# Altium schematic sheet Temperature.SchDoc
size A4; PageSetup: Record=PageOptions|CenterHorizontal=True|CenterVertical=True|PrintScale=1.00|XCorrection=1.00|YCorrection=1.00|PrintKind=1|BorderSize=5000000|LeftOffset=0|BottomOffset=0|Orientation=2|PaperLength=1000|PaperWidth=1000|Scale=100|PaperSource=7|PrintQuality=-4|MediaType=1|DitherType=10|PaperKind=A4 (210 x 297 mm)|PrintScaleMode=1
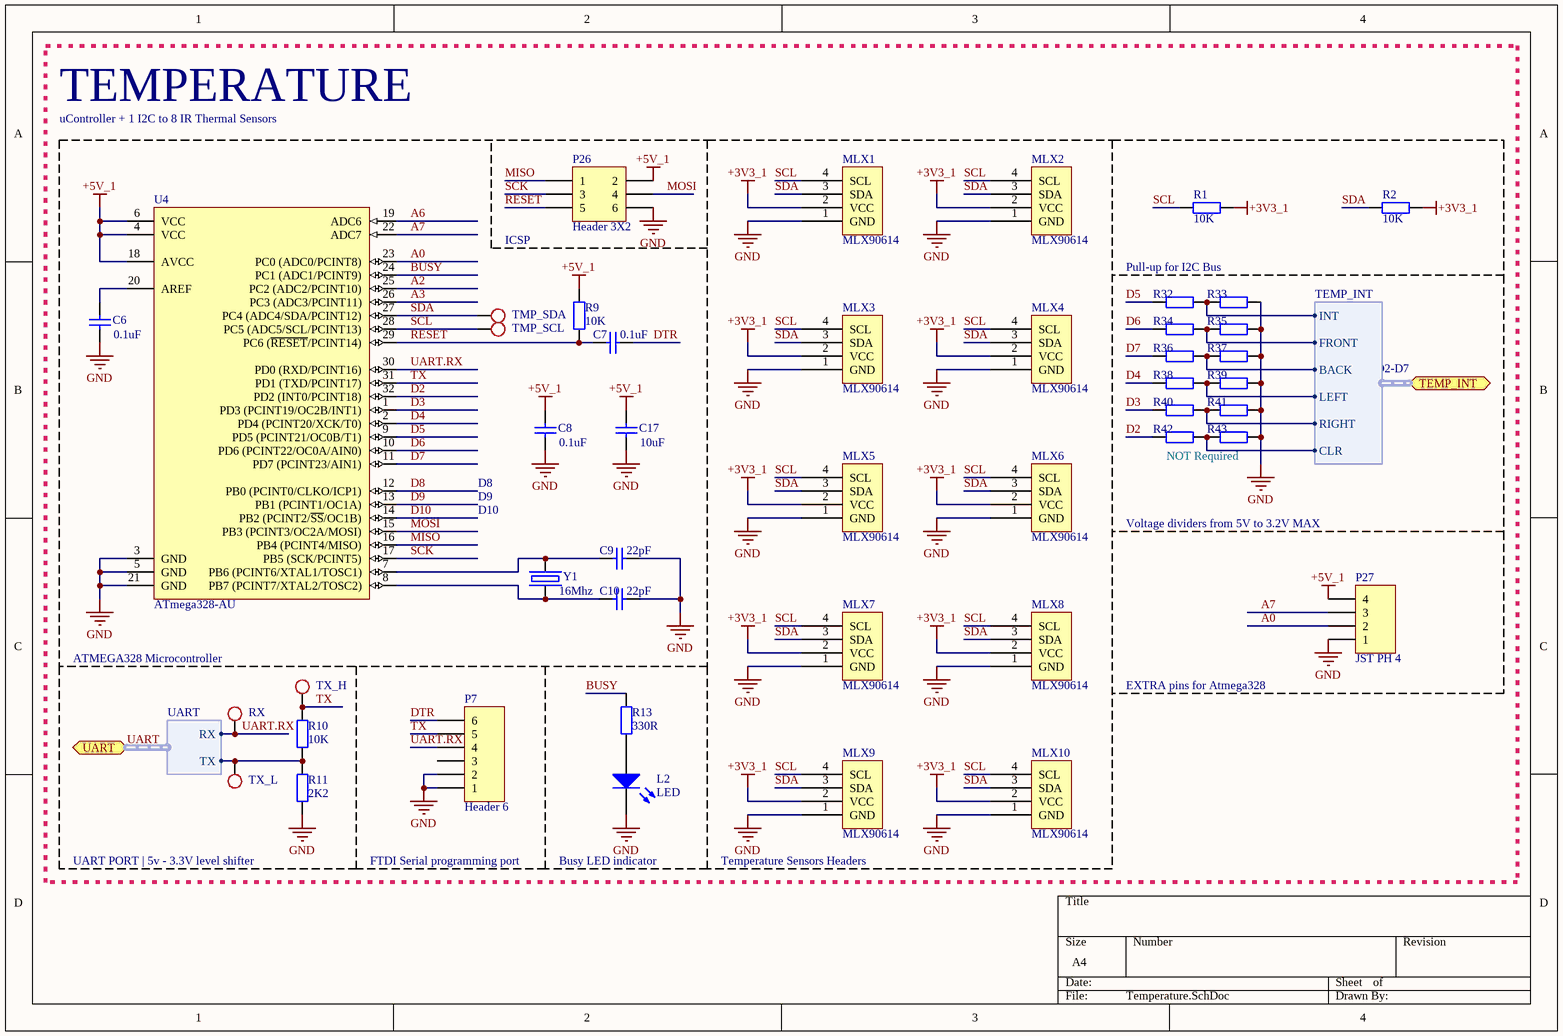
[diagram p0: Temperature.SchDoc]

## Parts
C6  0.1uF  [C0805]
C7  0.1uF  [C0805]
C8  0.1uF  [C0805]
C9  22pF  [C0805]
C10  22pF  [C0805]
C17  10uF  [C1206]
L2  LED  [LED0805]
MLX1  MLX90614  [MLX-BREAKOUT]
MLX2  MLX90614  [MLX-BREAKOUT]
MLX3  MLX90614  [MLX-BREAKOUT]
MLX4  MLX90614  [MLX-BREAKOUT]
MLX5  MLX90614  [MLX-BREAKOUT]
MLX6  MLX90614  [MLX-BREAKOUT]
MLX7  MLX90614  [MLX-BREAKOUT]
MLX8  MLX90614  [MLX-BREAKOUT]
MLX9  MLX90614  [MLX-BREAKOUT]
MLX10  MLX90614  [MLX-BREAKOUT]
P7  Header 6  [HDR1X6]
P26  Header 3X2  [HDR2X3]
P27  JST PH 4  [B4B-PH-K]
R1  10K  [RES1206]
R2  10K  [RES1206]
R9  10K  [RES1206]
R10  10K  [RES1206]
R11  2K2  [RES1206]
R13  330R  [RES1206]
R32  10K  [RES1206]  (value not drawn)
R33  2K2  [RES1206]  (value not drawn)
R34  10K  [RES1206]  (value not drawn)
R35  2K2  [RES1206]  (value not drawn)
R36  10K  [RES1206]  (value not drawn)
R37  2K2  [RES1206]  (value not drawn)
R38  10K  [RES1206]  (value not drawn)
R39  2K2  [RES1206]  (value not drawn)
R40  10K  [RES1206]  (value not drawn)
R41  2K2  [RES1206]  (value not drawn)
R42  10K  [RES1206]  (value not drawn)
R43  2K2  [RES1206]  (value not drawn)
RX  Test Point  [TP1]  (value not drawn)  (no BOM)
TMP_SCL  Test Point  [TP1]  (value not drawn)  (no BOM)
TMP_SDA  Test Point  [TP1]  (value not drawn)  (no BOM)
TX_H  Test Point  [TP1]  (value not drawn)  (no BOM)
TX_L  Test Point  [TP1]  (value not drawn)  (no BOM)
U4  ATmega328-AU  [32A_N]
Y1  16Mhz  [OSC-2-PIN-TH]

## Ports
TEMP_INT (harness TEMP_INT), UART (harness UART)

## Harnesses
UART: RX, TX
TEMP_INT: INT, FRONT, BACK, LEFT, RIGHT, CLR

## Nets
+3V3_1: MLX1.2(VCC) MLX2.2(VCC) MLX3.2(VCC) MLX4.2(VCC) MLX5.2(VCC) MLX6.2(VCC) MLX7.2(VCC) MLX8.2(VCC) MLX9.2(VCC) MLX10.2(VCC) R1.2 R2.2
+5V_1: C8.2 C17.2 P26.2 P27.4 R9.1 U4.4(VCC) U4.6(VCC) U4.18(AVCC)
GND: C6.1 C8.1 C9.2 C10.2 C17.1 L2.2(K) MLX1.1(GND) MLX2.1(GND) MLX3.1(GND) MLX4.1(GND) MLX5.1(GND) MLX6.1(GND) MLX7.1(GND) MLX8.1(GND) MLX9.1(GND) MLX10.1(GND) P7.1 P7.2 P26.6 P27.1 R11.1 R33.2 R35.2 R37.2 R39.2 R41.2 R43.2 U4.3(GND) U4.5(GND) U4.21(GND)
A0: P27.2 U4.23(PC0_(ADC0/PCINT8))
A2: U4.25(PC2_(ADC2/PCINT10))
A3: U4.26(PC3_(ADC3/PCINT11))
A6: U4.19(ADC6)
A7: P27.3 U4.22(ADC7)
BUSY: R13.2 U4.24(PC1_(ADC1/PCINT9))
D2: R42.1 U4.32(PD2_(INT0/PCINT18))
D3: R40.1 U4.1(PD3_(PCINT19/OC2B/INT1))
D4: R38.1 U4.2(PD4_(PCINT20/XCK/T0))
D5: R32.1 U4.9(PD5_(PCINT21/OC0B/T1))
D6: R34.1 U4.10(PD6_(PCINT22/OC0A/AIN0))
D7: R36.1 U4.11(PD7_(PCINT23/AIN1))
D8: U4.12(PB0_(PCINT0/CLKO/ICP1))
D9: U4.13(PB1_(PCINT1/OC1A))
D10: U4.14(PB2_(PCINT2/~{SS}/OC1B))
DTR: C7.2 P7.6
MISO: P26.1 U4.16(PB4_(PCINT4/MISO))
MOSI: P26.4 U4.15(PB3_(PCINT3/OC2A/MOSI))
RESET: C7.1 P26.5 R9.2 U4.29(PC6_(~{RESET}/PCINT14))
SCK: P26.3 U4.17(PB5_(SCK/PCINT5))
SCL: MLX1.4(SCL) MLX2.4(SCL) MLX3.4(SCL) MLX4.4(SCL) MLX5.4(SCL) MLX6.4(SCL) MLX7.4(SCL) MLX8.4(SCL) MLX9.4(SCL) MLX10.4(SCL) R1.1 TMP_SCL.1 U4.28(PC5_(ADC5/SCL/PCINT13))
SDA: MLX1.3(SDA) MLX2.3(SDA) MLX3.3(SDA) MLX4.3(SDA) MLX5.3(SDA) MLX6.3(SDA) MLX7.3(SDA) MLX8.3(SDA) MLX9.3(SDA) MLX10.3(SDA) R2.1 TMP_SDA.1 U4.27(PC4_(ADC4/SDA/PCINT12))
TX: P7.5 R10.2 TX_H.1 U4.31(PD1_(TXD/PCINT17))
UART.RX: P7.4 RX.1 U4.30(PD0_(RXD/PCINT16)) ; port UART.RX
UART.TX: R10.1 R11.2 TX_L.1 ; port UART.TX
NetC6_2: C6.2 U4.20(AREF)
NetC9_1: C9.1 U4.7(PB6_(PCINT6/XTAL1/TOSC1)) Y1.1
NetC10_1: C10.1 U4.8(PB7_(PCINT7/XTAL2/TOSC2)) Y1.2
NetL2_1: L2.1(A) R13.1
NetR32_2: R32.2 R33.1 ; port TEMP_INT.INT
NetR34_2: R34.2 R35.1 ; port TEMP_INT.FRONT
NetR36_2: R36.2 R37.1 ; port TEMP_INT.BACK
NetR38_2: R38.2 R39.1 ; port TEMP_INT.LEFT
NetR40_2: R40.2 R41.1 ; port TEMP_INT.RIGHT
NetR42_2: R42.2 R43.1 ; port TEMP_INT.CLR

Not connected (* = marked no-connect by the designer): P7 3

## Buses and harness runs
harness UART = port UART

## Notes on the sheet
- TEMPERATURE
- uController + 1 I2C to 8 IR Thermal Sensors
- ICSP
- Pull-up for I2C Bus
- D2-D7
- D8
- D9
- D10
- NOT Required
- Voltage dividers from 5V to 3.2V MAX
- ATMEGA328 Microcontroller
- EXTRA pins for Atmega328
- UART PORT | 5v - 3.3V level shifter
- FTDI Serial programming port
- Busy LED indicator
- (near MLX9) Temperature Sensors Headers

## Library data of the parts
C6-C10 C17 = Cap Semi: Capacitor (Semiconductor SIM Model); Published: 8-Jun-2000; LatestRevisionDate: 29-May-2009; LatestRevisionNote: IPC-7351 Footprint Added.; PackageReference: C1206; Publisher: Altium Limited; PackageDescription: Chip Capacitor
MLX1-MLX10 = MLX-BREAKOUT
P7 = Header 6: Header, 6-Pin; LatestRevisionDate: 17-Jul-2002; LatestRevisionNote: Re-released for DXP Platform.; Publisher: Altium Limited
P26 = Header 3X2: Header, 3-Pin, Dual row; LatestRevisionDate: 17-Jul-2002; LatestRevisionNote: Re-released for DXP Platform.; Publisher: Altium Limited
R1 R2 R9-R11 R13 R32-R43 = RES
RX TMP_SCL TMP_SDA TX_H TX_L = Test Point: Test Point for Osciloscope measurements
U4 = ATmega328-AU: 8-bit AVR Microcontroller, 32KB Flash, 1KB EEPROM, 2KB SRAM, 32-pin TQFP, Industrial Grade (-40°C to 85°C); Published: 1-Apr-2010; DatasheetVersion: revA, Jan-2010; PackageVersion: revB, Oct-2001; PackageReference: 32A; Publisher: Altium Limited; PackageDescription: 32-Lead, 7x7x1.0 mm Body, 0.8mm Lead Pitch, Thin Profile Plastic Quad Flat Package (TQFP); Supplier 1: Digi-Key; Supplier Part Number 1: ATMEGA328-AU-ND; Supplier 2: Mouser; Supplier Part Number 2: 556-ATMEGA328-AU; Code_JEDEC: MS-026-ABA; ComponentLink1Description: Manufacturer Link; ComponentLink1URL: http://www.atmel.com/products/avr/default.asp?; ComponentLink2Description: ATmega48A/48PA/88A/88PA/168A/168PA/328/328P Datasheet; ComponentLink2URL: http://www.atmel.com/dyn/resources/prod_documents/8271.pdf; ComponentLink3Description: ATmega48A/48PA/88A/88PA/168A/168PA/328/328P Summary; ComponentLink3URL: http://www.atmel.com/dyn/resources/prod_documents/8271S.pdf; ComponentLink4Description: Atmel.com Home; ComponentLink4URL: http://www.atmel.com
Y1 = OSC-2-PIN: 2 pin oscilator